# Altium schematic sheet top.SchDoc
size A4
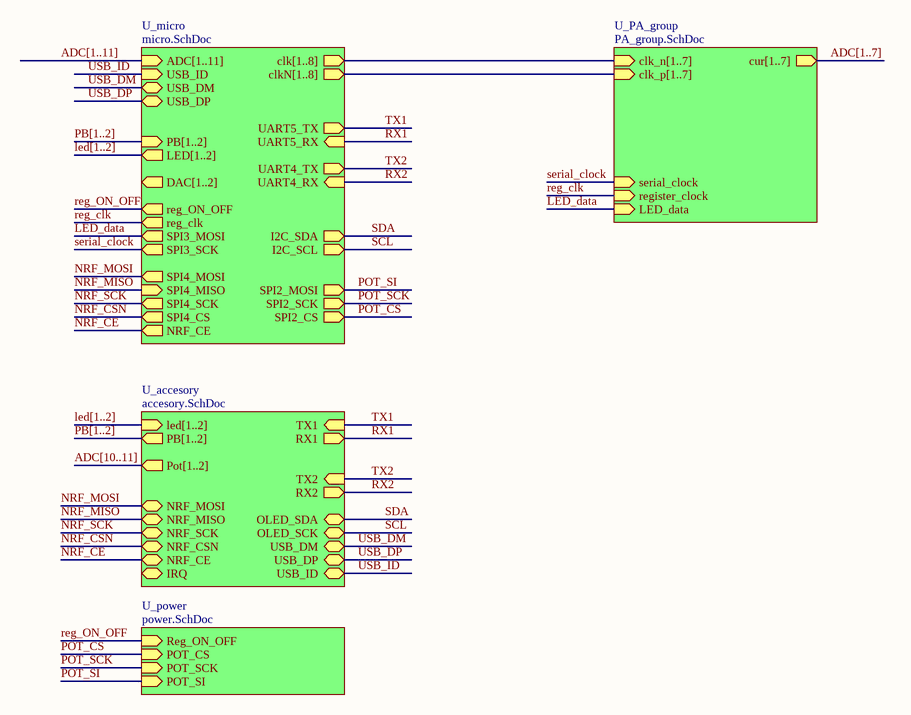
[diagram p0: top.SchDoc]

## Sub-sheets
U_accesory = accesory.SchDoc: led[1..2] (in), PB[1..2] (out), Pot[1..2] (out), OLED_SCK (bidir), OLED_SDA (bidir), NRF_MISO (bidir), NRF_MOSI (bidir), NRF_SCK (bidir), NRF_CSN (bidir), NRF_CE (bidir), IRQ (bidir), RX1 (out), RX2 (out), TX1 (in), TX2 (in), USB_DM (bidir), USB_DP (bidir), USB_ID (bidir)
U_micro = micro.SchDoc: ADC[1..11] (in), DAC[1..2] (out), USB_ID (in), USB_DM (bidir), USB_DP (bidir), clk[1..8] (out), clkN[1..8] (out), SPI2_MOSI (out), SPI3_SCK (out), UART5_TX (out), SPI4_SCK (out), SPI4_CS (out), SPI4_MISO (in), SPI4_MOSI (out), SPI3_MOSI (out), UART5_RX (in), SPI2_SCK (out), SPI2_CS (out), I2C_SDA (out), I2C_SCL (out), LED[1..2] (out), PB[1..2] (in), reg_clk (out), reg_ON_OFF (out), NRF_CE (out), UART4_RX (in), UART4_TX (out)
U_PA_group = PA_group.SchDoc: serial_clock (in), register_clock (in), LED_data (in), clk_n[1..7] (in), clk_p[1..7] (in), cur[1..7] (out)
U_power = power.SchDoc: Reg_ON_OFF (in), POT_CS (in), POT_SCK (in), POT_SI (in)

## Nets
LED_data: sheet U_micro/SPI3_MOSI, sheet U_PA_group/LED_data
NRF_CE: sheet U_micro/NRF_CE, sheet U_accesory/NRF_CE
NRF_CSN: sheet U_micro/SPI4_CS, sheet U_accesory/NRF_CSN
NRF_MISO: sheet U_micro/SPI4_MISO, sheet U_accesory/NRF_MISO
NRF_MOSI: sheet U_micro/SPI4_MOSI, sheet U_accesory/NRF_MOSI
NRF_SCK: sheet U_micro/SPI4_SCK, sheet U_accesory/NRF_SCK
POT_CS: sheet U_micro/SPI2_CS, sheet U_power/POT_CS
POT_SCK: sheet U_micro/SPI2_SCK, sheet U_power/POT_SCK
POT_SI: sheet U_micro/SPI2_MOSI, sheet U_power/POT_SI
reg_clk: sheet U_micro/reg_clk, sheet U_PA_group/register_clock
reg_ON_OFF: sheet U_micro/reg_ON_OFF, sheet U_power/Reg_ON_OFF
RX1: sheet U_micro/UART5_RX, sheet U_accesory/RX1
RX2: sheet U_micro/UART4_RX, sheet U_accesory/RX2
SCL: sheet U_micro/I2C_SCL, sheet U_accesory/OLED_SCK
SDA: sheet U_micro/I2C_SDA, sheet U_accesory/OLED_SDA
serial_clock: sheet U_micro/SPI3_SCK, sheet U_PA_group/serial_clock
TX1: sheet U_micro/UART5_TX, sheet U_accesory/TX1
TX2: sheet U_micro/UART4_TX, sheet U_accesory/TX2
USB_DM: sheet U_micro/USB_DM, sheet U_accesory/USB_DM
USB_DP: sheet U_micro/USB_DP, sheet U_accesory/USB_DP
USB_ID: sheet U_micro/USB_ID, sheet U_accesory/USB_ID

## Buses and harness runs
bus ADC[1..7] = sheet U_PA_group/cur[1..7]
bus ADC[1..11] = sheet U_micro/ADC[1..11]
bus ADC[10..11] = sheet U_accesory/Pot[1..2]
bus led[1..2] = sheet U_accesory/led[1..2]
bus led[1..2] = sheet U_micro/LED[1..2]
bus PB[1..2] = sheet U_accesory/PB[1..2]
bus PB[1..2] = sheet U_micro/PB[1..2]
bus sheet U_micro/clk[1..8] = sheet U_PA_group/clk_n[1..7]
bus sheet U_micro/clkN[1..8] = sheet U_PA_group/clk_p[1..7]